# Altium schematic sheet Schematic.SchDoc: BME280 Schematic
size A4; Organization: Altium Limited; Address1: L3, 12a Rodborough Rd; Address2: Frenchs Forest; Address3: NSW; Address4: Australia 2086; DocumentNumber: 1; Revision: 1.0; SheetNumber: 1; SheetTotal: 1
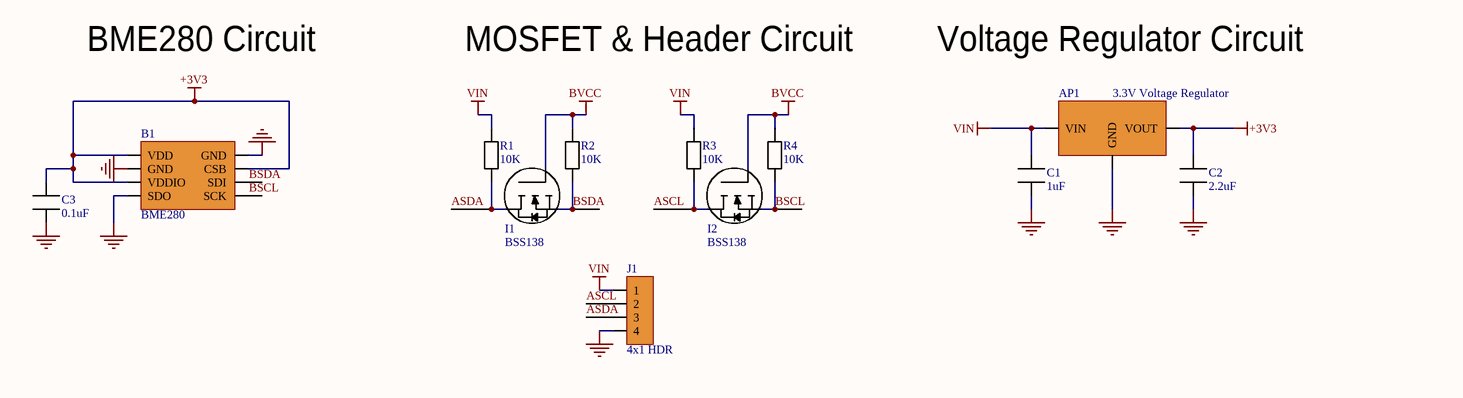
[diagram p0: Schematic.SchDoc]

## Parts
AP1  3.3V Voltage Regulator  [Voltage Regulator]
B1  BME280  [BME280]
C1  1uF  [0.1uF Capcaitor]
C2  2.2uF  [22uF Capacitor]
C3  0.1uF  [0.1uF Capcaitor]
I1  BSS138  [MOSFET]
I2  BSS138  [MOSFET]
J1  4x1 HDR  [Header 4x1]
R1  10K  [10K Resistor]
R2  10K  [10K Resistor]
R3  10K  [10K Resistor]
R4  10K  [10K Resistor]

## Nets
+3V3: AP1.1(VOUT) B1.2(CSB) B1.6(VDDIO) B1.8(VDD) C2.2 C3.2
BVCC: I1.1 I2.1 R2.2 R4.2
GND: AP1.2(GND) B1.1(GND) B1.5(SDO) B1.7(GND) C1.1 C2.1 C3.1 J1.4
VIN: AP1.3(VIN) C1.2 J1.1 R1.2 R3.2
ASCL: I2.2 J1.2 R3.1
ASDA: I1.2 J1.3 R1.1
BSCL: B1.4(SCK) I2.3 R4.1
BSDA: B1.3(SDI) I1.3 R2.1

## Notes on the sheet
- BME280 Circuit
- MOSFET & Header Circuit
- Voltage Regulator Circuit
- Title
- Size:
- Date:
- A4
- Number:
- Time:
- Revision:
- Sheet
- of
- File:

## Library data of the parts
AP1 = AP7381-33Y-13: IC REG LINEAR 3.3V 150MA SOT89; Manufacturer: Diodes; Output Type: Fixed; Output Configuration: Positive; Number of Regulators: 1; Max Input Voltage: 40V; Dropout Voltage: 1V; Quiescent Current: 2.5uA; Max Supply Current: 25uA; Supplier 1: Digi-Key; Manufacturer Part Number: AP7381-33Y-13; RoHS: Yes; Category: Voltage Regulators - Linear; Stock 1: 64223; Pricing 1: 1=0.46000, 10=0.34900, 25=0.31440, 100=0.17140, 250=0.16568, 500=0.14854, 1000=0.11427 (USD); Mount: Surface Mount; Case/Package: SOT-89; Min Operating Temperature: -40°C; Max Operating Temperature: 125°C; Packaging: Tape and Reel; Min Output Voltage: 3.3V; Output Current: 150mA; RoHS Compliant: Yes; ComponentLink1URL: https://www.diodes.com/assets/Datasheets/AP7381.pdf?src-supplier=Digi-Key; ComponentLink1Description: https://www.diodes.com/assets/Datasheets/AP7381.pdf?src-supplier=Digi-Key; Supplier Part Number 1: AP7381-33Y-13DICT-ND
B1 = BME280: Pressure, Temperature and Humidity Sensor Digital Output 1.8V 8-Pin LGA T/R; Manufacturer: Bosch; Output Type: SPI,I2C; Accuracy: 3%; Response Time: 1s; Supplier 1: Digi-Key; Manufacturer Part Number: BME280; RoHS: No; Category: Pressure Sensors; Pricing 1: 1=5.95000, 5=5.25000, 10=4.63800, 25=3.76240, 50=3.32500, 100=3.23750, 500=2.71250, 1000=2.53750, 5000=2.45000 (USD); Mount: Surface Mount; Case/Package: LGA; Number of Pins: 8; Min Operating Temperature: -40°C; Max Operating Temperature: 85°C; Sensor Type: Temperature; Packaging: Cut Tape; Lead Free: Lead Free; ComponentLink1URL: https://ae-bst.resource.bosch.com/media/_tech/media/product_flyer/BME280_Productflyer_BST_20170109.pdf?src-supplier=Arrow+Electronics; ComponentLink1Description: https://ae-bst.resource.bosch.com/media/_tech/media/product_flyer/BME280_Productflyer_BST_20170109.pdf?src-supplier=Arrow+Electronics; ComponentLink2URL: https://ae-bst.resource.bosch.com/media/_tech/media/datasheets/BST-BME280-DS002.pdf?src-supplier=Digi-Key; ComponentLink2Description: https://ae-bst.resource.bosch.com/media/_tech/media/datasheets/BST-BME280-DS002.pdf?src-supplier=Digi-Key; ComponentLink3URL: https://ae-bst.resource.bosch.com/media/_tech/media/product_flyer/BME280_Productflyer_BST_20170109.pdf?src-supplier=Mouser; ComponentLink3Description: https://ae-bst.resource.bosch.com/media/_tech/media/product_flyer/BME280_Productflyer_BST_20170109.pdf?src-supplier=Mouser; ComponentLink4URL: https://ae-bst.resource.bosch.com/media/_tech/media/product_flyer/BME280_Productflyer_BST_20170109.pdf?src-supplier=NAC+Semi; ComponentLink4Description: https://ae-bst.resource.bosch.com/media/_tech/media/product_flyer/BME280_Productflyer_BST_20170109.pdf?src-supplier=NAC+Semi; Supplier Part Number 1: 828-1063-1-ND
C1 = LMK105BJ105KV-F: Manufacturer: Taiyo Yuden; Tolerance: 10%; Voltage Rating (DC): 10V; Dielectric: X5R; Supplier 1: Digi-Key; Manufacturer Part Number: LMK105BJ105KV-F; RoHS: Yes; Category: Ceramic Capacitors; Stock 1: 2097360; Pricing 1: 1=0.11000, 10=0.07900, 50=0.04280, 100=0.03500, 500=0.02502, 1000=0.01966, 2500=0.01788, 5000=0.01644 (USD); Mount: Surface Mount; Case/Package: 0402; Case Code (Imperial): 0402; Case Code (Metric): 1005; Min Operating Temperature: -55°C; Max Operating Temperature: 85°C; Capacitance: 1uF; Packaging: Tape and Reel; Package Quantity: 1; Voltage Rating: 10V; Termination: SMD/SMT; Resistor Type: Ceramic; Series: M; Construction: Flat; Length: 1mm; Width: 0.5mm; Height: 0.5mm; Thickness: 0.022inch; Depth: 0.5mm; Radiation Hardening: No; Lead Free: Lead Free; Halogen Free: Halogen Free; REACH SVHC: Unknown; RoHS Compliant: Yes; ComponentLink1URL: https://datasheet.ciiva.com/26872/getdatasheetpartid-637441-26872608.pdf?src-supplier=Verical; ComponentLink1Description: https://datasheet.ciiva.com/26872/getdatasheetpartid-637441-26872608.pdf?src-supplier=Verical; ComponentLink2URL: https://datasheet.ciiva.com/15921/463lmk105bj105kv-f-15921218.pdf?src-supplier=Onlinecomponents.com; ComponentLink2Description: https://datasheet.ciiva.com/15921/463lmk105bj105kv-f-15921218.pdf?src-supplier=Onlinecomponents.com; ComponentLink3URL: https://datasheet.ciiva.com/131/lmk105bj105kv-f-ss-131735.pdf?src-supplier=Digi-Key; ComponentLink3Description: https://datasheet.ciiva.com/131/lmk105bj105kv-f-ss-131735.pdf?src-supplier=Digi-Key; ComponentLink4URL: https://datasheet.ciiva.com/30256/308lmk105bj105kv-f-30256903.pdf?src-supplier=Onlinecomponents.com; ComponentLink4Description: https://datasheet.ciiva.com/30256/308lmk105bj105kv-f-30256903.pdf?src-supplier=Onlinecomponents.com; Supplier Part Number 1: 587-1454-1-ND
C2 = LMK105BJ225MV-F: TAIYO YUDEN         LMK105BJ225MV-F            CERAMIC CAPACITOR, 2.2UF, 10V, X5R, 20%, 0402; Supplier 1: Digi-Key; Manufacturer: Taiyo Yuden; Manufacturer Part Number: LMK105BJ225MV-F; RoHS: Yes; Category: Ceramic Capacitors; Stock 1: 427960; Pricing 1: 1=0.10000, 10=0.05800, 50=0.03160, 100=0.02590, 500=0.01848, 1000=0.01452, 2500=0.01320, 5000=0.01214 (USD); Mount: Surface Mount; Case/Package: 0402; Case Code (Imperial): 0402; Case Code (Metric): 1005; Min Operating Temperature: -55°C; Max Operating Temperature: 85°C; Packaging: Tape and Reel; Capacitance: 2.2uF; Tolerance: 20%; Voltage Rating: 10V; Package Quantity: 1; Voltage Rating (DC): 10V; Dielectric: X5R; Termination: SMD/SMT; Resistor Type: Ceramic; Series: M; Construction: Flat; Length: 1mm; Width: 0.5mm; Height: 0.5mm; Thickness: 0.022inch; Depth: 0.5mm; Radiation Hardening: No; REACH SVHC: Unknown; Halogen Free: Halogen Free; RoHS Compliant: Yes; ComponentLink1URL: https://datasheet.ciiva.com/30190/500lmk105bj225mv-f-30190498.pdf?src-supplier=Onlinecomponents.com; ComponentLink1Description: https://datasheet.ciiva.com/30190/500lmk105bj225mv-f-30190498.pdf?src-supplier=Onlinecomponents.com; ComponentLink2URL: https://datasheet.ciiva.com/23631/lmk105bj225mv-f-ss-23631491.pdf?src-supplier=Newark; ComponentLink2Description: https://datasheet.ciiva.com/23631/lmk105bj225mv-f-ss-23631491.pdf?src-supplier=Newark; ComponentLink3URL: https://datasheet.ciiva.com/134/lmk105bj225mv-f-ss-134677.pdf?src-supplier=Digi-Key; ComponentLink3Description: https://datasheet.ciiva.com/134/lmk105bj225mv-f-ss-134677.pdf?src-supplier=Digi-Key; ComponentLink4URL: https://datasheet.ciiva.com/15921/286lmk105bj225mv-f-15921222.pdf?src-supplier=Onlinecomponents.com; ComponentLink4Description: https://datasheet.ciiva.com/15921/286lmk105bj225mv-f-15921222.pdf?src-supplier=Onlinecomponents.com; Supplier Part Number 1: 587-3153-1-ND
C3 = EMK105BJ104KV-F: TAIYO YUDEN - EMK105BJ104KV-F - CERAMIC CAPACITOR, 0.1UF, 16V, X5R, 10%, 0402, FULL REEL; Capacitance: 100nF; Supplier 1: Digi-Key; Manufacturer: Taiyo Yuden; Manufacturer Part Number: EMK105BJ104KV-F; RoHS: Yes; Category: Ceramic Capacitors; Stock 1: 2258348; Pricing 1: 1=0.10000, 10=0.02100, 50=0.01120, 100=0.00920, 500=0.00654, 1000=0.00514, 2500=0.00468, 5000=0.00430 (USD); Mount: Surface Mount; Case/Package: 0402; Number of Pins: 2; Case Code (Metric): 1005; Case Code (Imperial): 0402; Contact Plating: Tin; Min Operating Temperature: -55°C; Max Operating Temperature: 85°C; Tolerance: 10%; Packaging: Tape and Reel; Voltage Rating (DC): 16V; Dielectric: X5R; Voltage Rating: 16V; Package Quantity: 1; Termination: SMD/SMT; Resistor Type: Ceramic; Series: M; Construction: Flat; Length: 1mm; Width: 0.02inch; Height: 0.5mm; Thickness: 0.022inch; Depth: 0.5mm; Radiation Hardening: No; Lead Free: Lead Free; Halogen Free: Halogen Free; REACH SVHC: No SVHC; RoHS Compliant: Yes; ComponentLink1URL: https://datasheet.ciiva.com/30156/744emk105bj104kv-f-30156673.pdf?src-supplier=Onlinecomponents.com; ComponentLink1Description: https://datasheet.ciiva.com/30156/744emk105bj104kv-f-30156673.pdf?src-supplier=Onlinecomponents.com; ComponentLink2URL: https://datasheet.ciiva.com/30119/255emk105bj104kv-f-30119734.pdf?src-supplier=Onlinecomponents.com; ComponentLink2Description: https://datasheet.ciiva.com/30119/255emk105bj104kv-f-30119734.pdf?src-supplier=Onlinecomponents.com; ComponentLink3URL: https://datasheet.ciiva.com/129/emk105bj104kv-f-ss-129786.pdf?src-supplier=Digi-Key; ComponentLink3Description: https://datasheet.ciiva.com/129/emk105bj104kv-f-ss-129786.pdf?src-supplier=Digi-Key; ComponentLink4URL: https://datasheet.ciiva.com/15920/1135emk105bj104kv-f-15920444.pdf?src-supplier=Onlinecomponents.com; ComponentLink4Description: https://datasheet.ciiva.com/15920/1135emk105bj104kv-f-15920444.pdf?src-supplier=Onlinecomponents.com; ComponentLink5URL: https://datasheet.ciiva.com/5443/mlcc-all-e-541559-5443819.pdf?src-supplier=Mouser; ComponentLink5Description: https://datasheet.ciiva.com/5443/mlcc-all-e-541559-5443819.pdf?src-supplier=Mouser; Supplier Part Number 1: 587-1226-1-ND
I1 I2 = BSS138: Trans MOSFET N-CH 50V 0.22A 3-Pin SOT-23 T/R; Manufacturer: ON Semiconductor / Fairchild; On-State Resistance: 6R; Current Rating: 220mA; Fall Time: 9ns; Drain to Source Resistance: 3.5R; Power Dissipation: 360mW; Turn-Off Delay Time: 20ns; Turn-On Delay Time: 2.5ns; Threshold Voltage: 1.3V; Element Configuration: Single; Gate to Source Voltage (Vgs): 20V; Input Capacitance: 27pF; Number of Elements: 1; Supplier 1: Digi-Key; Manufacturer Part Number: BSS138; RoHS: Yes; Category: MOSFETs; Stock 1: 395456; Pricing 1: 1=0.26000, 10=0.18200, 25=0.17120, 100=0.08860, 500=0.07392, 1000=0.05136 (USD); Mount: Surface Mount; Case/Package: SOT-23; Number of Pins: 3; Contact Plating: Tin,Matte; Weight: 0.03g; Min Operating Temperature: -55°C; Max Operating Temperature: 150°C; Voltage Rating (DC): 50V; Drain to Source Voltage (Vdss): 50V; Continuous Drain Current (ID): 220mA; Drain to Source Breakdown Voltage: 50V; Termination: SMD/SMT; Dual Supply Voltage: 50V; Rds On Max: 3.5R; Packaging: Tape and Reel; Nominal Vgs: 1.3V; Max Power Dissipation: 360mW; Rise Time: 9ns; Package Quantity: 1; Length: 2.92mm; Width: 1.3mm; Height: 0.93mm; Radiation Hardening: No; Lead Free: Lead Free; REACH SVHC: No SVHC; ComponentLink1URL: https://datasheet.ciiva.com/1190/193736-1190130.pdf?src-supplier=Element14; ComponentLink1Description: https://datasheet.ciiva.com/1190/193736-1190130.pdf?src-supplier=Element14; ComponentLink2URL: https://datasheet.ciiva.com/931/bss138-931776.pdf?src-supplier=Digi-Key; ComponentLink2Description: https://datasheet.ciiva.com/931/bss138-931776.pdf?src-supplier=Digi-Key; ComponentLink3URL: https://datasheet.ciiva.com/1190/193736-1190131.pdf?src-supplier=Element14; ComponentLink3Description: https://datasheet.ciiva.com/1190/193736-1190131.pdf?src-supplier=Element14; ComponentLink4URL: https://datasheet.ciiva.com/1254/193736-1254983.pdf?src-supplier=Newark; ComponentLink4Description: https://datasheet.ciiva.com/1254/193736-1254983.pdf?src-supplier=Newark; ComponentLink5URL: https://datasheet.ciiva.com/22655/193736-22655240.pdf?src-supplier=Element14; ComponentLink5Description: https://datasheet.ciiva.com/22655/193736-22655240.pdf?src-supplier=Element14; ComponentLink6URL: https://datasheet.ciiva.com/26229/bss138-26229007.pdf?src-supplier=Avnet+Europe; ComponentLink6Description: https://datasheet.ciiva.com/26229/bss138-26229007.pdf?src-supplier=Avnet+Europe; ComponentLink7URL: https://datasheet.ciiva.com/3304/bss138-3304424.pdf?src-supplier=Avnet; ComponentLink7Description: https://datasheet.ciiva.com/3304/bss138-3304424.pdf?src-supplier=Avnet; ComponentLink8URL: https://datasheet.ciiva.com/16834/bss138-16834843.pdf?src-supplier=Future+Electronics; ComponentLink8Description: https://datasheet.ciiva.com/16834/bss138-16834843.pdf?src-supplier=Future+Electronics; ComponentLink9URL: https://datasheet.ciiva.com/27050/784896-27050043.pdf?src-supplier=Jameco; ComponentLink9Description: https://datasheet.ciiva.com/27050/784896-27050043.pdf?src-supplier=Jameco; Supplier Part Number 1: BSS138CT-ND
J1 = 61300411121: CONN HEADER VERT 4POS 2.54MM; Manufacturer: Wurth Electronics; Number of Positions: 4; Gender: Male; Connector Type: Male Pin; Pitch: 0.1inch; Supplier 1: Digi-Key; Manufacturer Part Number: 61300411121; RoHS: Yes; Category: Connectors; Stock 1: 23286; Pricing 1: 1=0.18000, 10=0.15300, 25=0.12720, 50=0.10600, 100=0.09600, 1000=0.08800 (USD); Mount: Through Hole; Contact Plating: Gold; Contact Material: Copper; Color: Black; Number of Rows: 1; Packaging: Bulk; Termination: Solder; Number of Contacts: 4; Contact Mating Length: 0.236inch; REACH SVHC: Unknown; Lead Free: Lead Free; RoHS Compliant: Yes; ComponentLink1URL: http://www.farnell.com/cad/1737268.pdf?src-supplier=Element14; ComponentLink1Description: http://www.farnell.com/cad/1737268.pdf?src-supplier=Element14; ComponentLink2URL: https://katalog.we-online.de/em/datasheet/6130xx11121.pdf?src-supplier=Digi-Key; ComponentLink2Description: https://katalog.we-online.de/em/datasheet/6130xx11121.pdf?src-supplier=Digi-Key; Supplier Part Number 1: 732-5317-ND
R1-R4 = RMCF0402FT10K0: RES 10K OHM 1% 1/16W 0402; Manufacturer: Stackpole Electronics; Resistance: 10kR; Power Rating: 62.5mW; Temperature Coefficient: 100ppm/°C; Max Power Dissipation: 63mW; Supplier 1: Digi-Key; Manufacturer Part Number: RMCF0402FT10K0; RoHS: Yes; Category: Chip SMD Resistors; Stock 1: 6284939; Pricing 1: 1=0.10000, 10=0.01300, 100=0.00530, 1000=0.00238, 2500=0.00207, 5000=0.00171 (USD); Mount: Surface Mount; Case/Package: 0402; Case Code (Metric): 1005; Case Code (Imperial): 0402; Contact Plating: Tin,Matte; Size Code: 0402; Min Operating Temperature: -55°C; Max Operating Temperature: 155°C; Tolerance: 1%; Packaging: Tape and Reel; Resistor Type: Thick Film; Number of Terminations: 2; Features: Automotive AEC-Q200; Series: RMCF; Construction: Rectangular; Length: 1mm; Width: 0.02inch; Height: 0.016inch; Depth: 0.5mm; Radiation Hardening: No; Military Standard: Not; Lead Free: Lead Free; RoHS Compliant: Yes; ComponentLink1URL: https://datasheet.ciiva.com/24341/sei-rmcp-24341800.pdf?src-supplier=Onlinecomponents.com; ComponentLink1Description: https://datasheet.ciiva.com/24341/sei-rmcp-24341800.pdf?src-supplier=Onlinecomponents.com; Supplier Part Number 1: RMCF0402FT10K0CT-ND